# EAGLE schematic IoT_2015 (EAGLE 7.3.0)
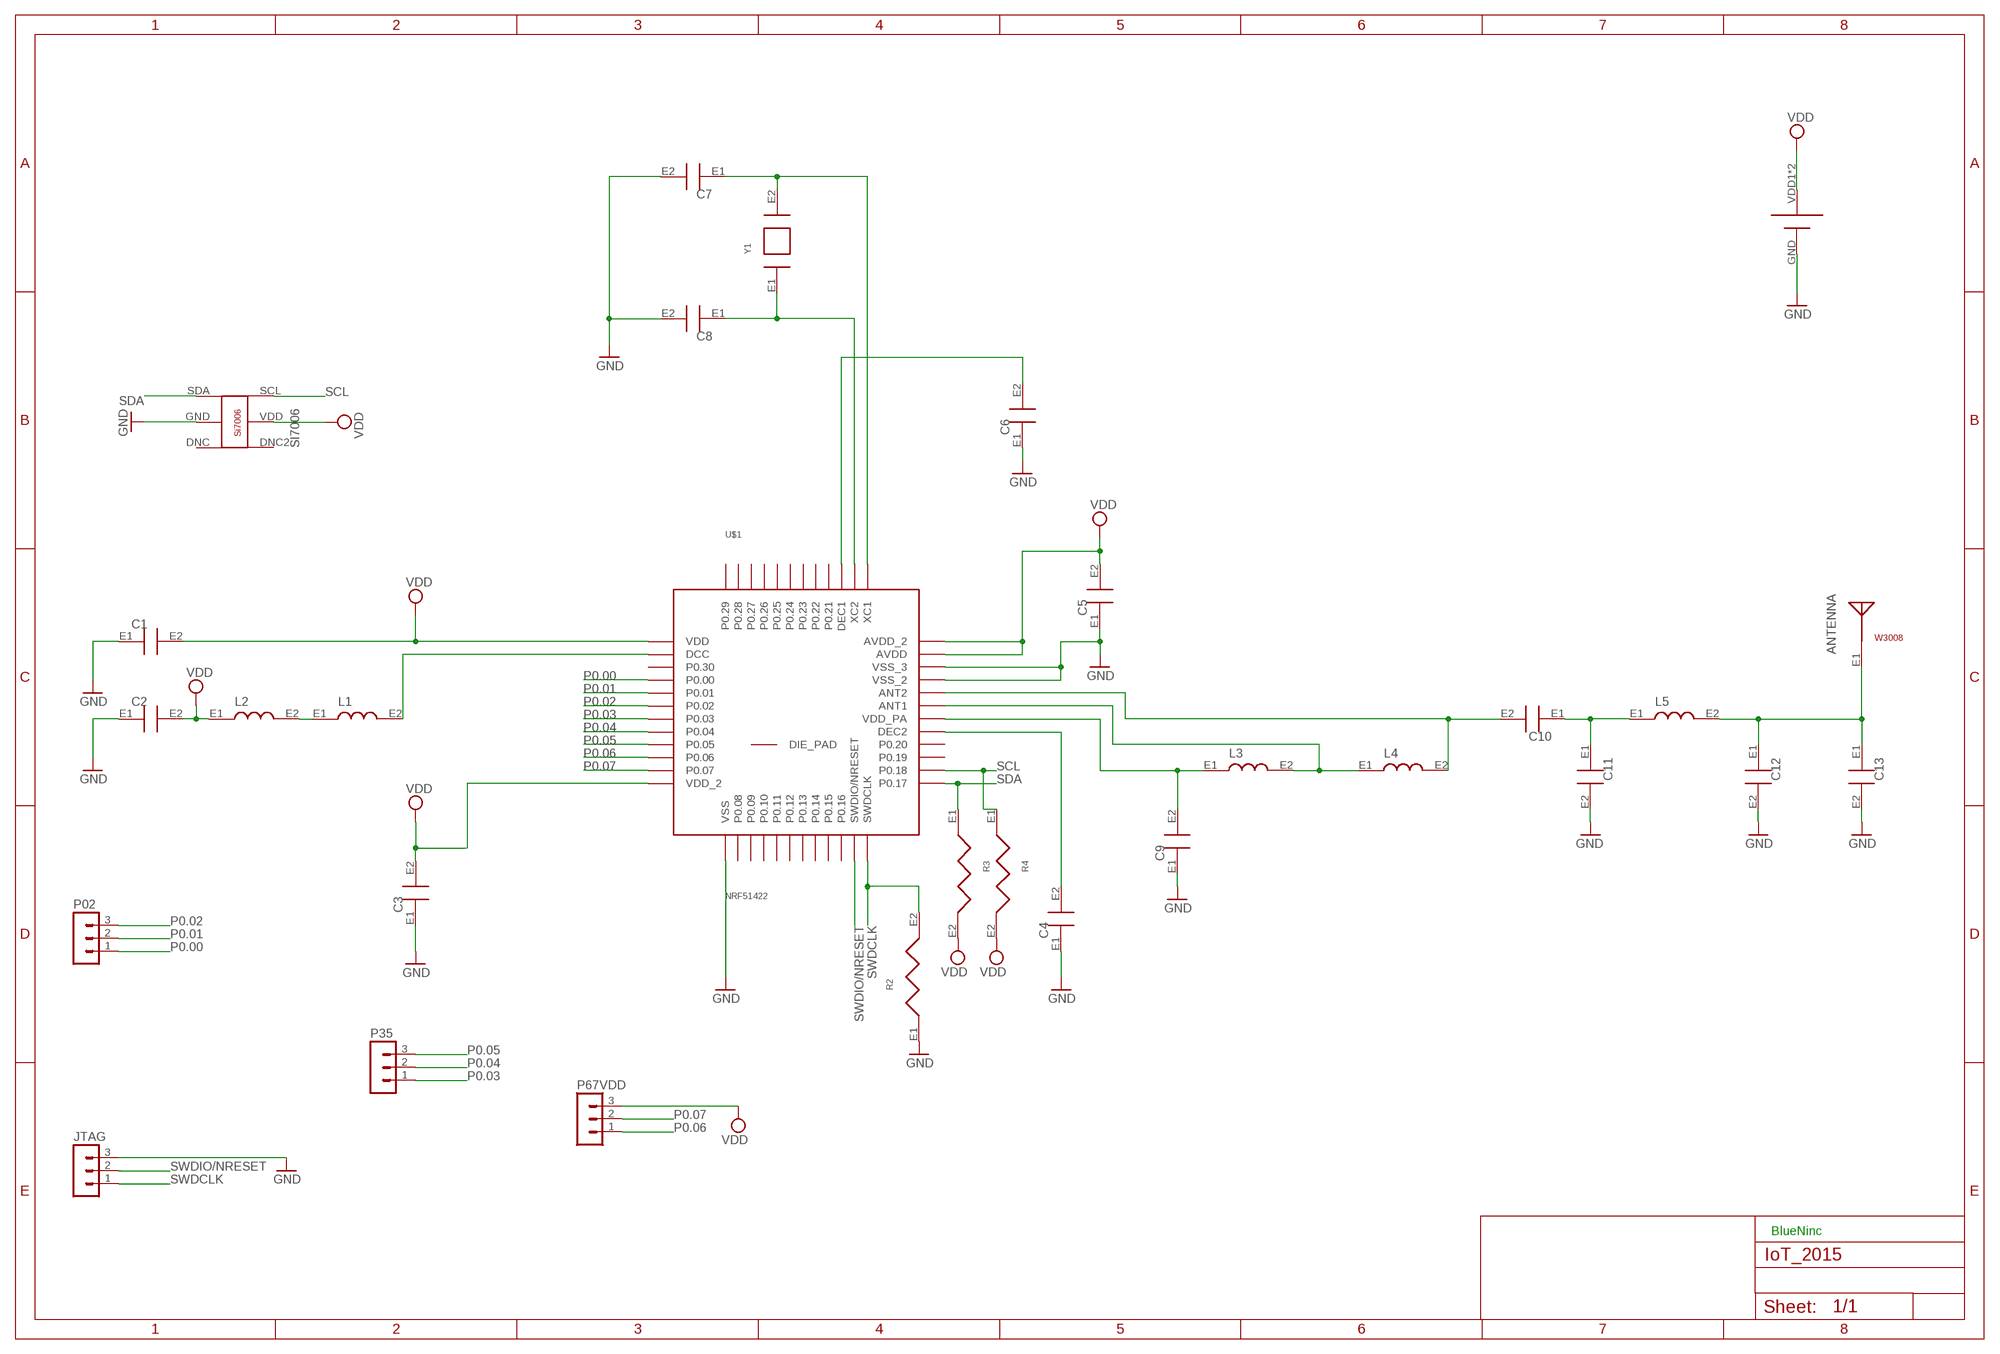
[diagram p0: schematic, sheet 1]

## Parts
ANTENNA  W3008  [W3008]
BATTERY  BAT-HLD-001  [BAT-HLD-001]
C1  VJ1603_W1BC  [VJ1603_W1BC]
C2  VJ1603_W1BC  [VJ1603_W1BC]
C3  VJ1603_W1BC  [VJ1603_W1BC]
C4  VJ1603_W1BC  [VJ1603_W1BC]
C5  VJ1603_W1BC  [VJ1603_W1BC]
C6  VJ1603_W1BC  [VJ1603_W1BC]
C7  VJ1603_W1BC  [VJ1603_W1BC]
C8  VJ1603_W1BC  [VJ1603_W1BC]
C9  VJ1603_W1BC  [VJ1603_W1BC]
C10  VJ1603_W1BC  [VJ1603_W1BC]
C11  VJ1603_W1BC  [VJ1603_W1BC]
C12  VJ1603_W1BC  [VJ1603_W1BC]
C13  VJ1603_W1BC  [VJ1603_W1BC]
JTAG  MA03-1  [MA03-1]
L1  JTI_CAT_2012_INDUCTORS_CHIP-242427  [JTI_CAT_2012_INDUCTORS_CHIP-242427]
L2  JTI_CAT_2012_INDUCTORS_CHIP-242427  [JTI_CAT_2012_INDUCTORS_CHIP-242427]
L3  JTI_CAT_2012_INDUCTORS_CHIP-242427  [JTI_CAT_2012_INDUCTORS_CHIP-242427]
L4  JTI_CAT_2012_INDUCTORS_CHIP-242427  [JTI_CAT_2012_INDUCTORS_CHIP-242427]
L5  JTI_CAT_2012_INDUCTORS_CHIP-242427  [JTI_CAT_2012_INDUCTORS_CHIP-242427]
P02  MA03-1  [MA03-1]
P35  MA03-1  [MA03-1]
P67VDD  MA03-1  [MA03-1]
R2  ERJ-3GEYJ103V  [ERJ-3GEYJ103V]
R3  ERJ-3GEYJ103V  [ERJ-3GEYJ103V]
R4  ERJ-3GEYJ103V  [ERJ-3GEYJ103V]
SI7006  SI7006-A20-IM  [SI7006-A20-IM]
U$1  NRF51422  [QFN48]
Y1  ABLS-16.000MHZ-B4-T  [ABLS-16.000MHZ-B4-T]

## Nets
GND: BATTERY.GND C1.E1 C2.E1 C3.E1 C4.E1 C5.E1 C6.E1 C7.E2 C8.E2 C9.E1 C11.E2 C12.E2 C13.E2 JTAG.3 R2.E1 SI7006.GND U$1.13(VSS) U$1.33(VSS_2) U$1.34(VSS_3)
N$1: L1.E1 L2.E2
N$2: L1.E2 U$1.2(DCC)
N$3: C4.E2 U$1.29(DEC2)
N$4: ANTENNA.E1 C12.E1 C13.E1 L5.E2
N$5: C9.E2 L3.E1 U$1.30(VDD_PA)
N$6: L3.E2 L4.E1 U$1.31(ANT1)
N$7: C10.E2 L4.E2 U$1.32(ANT2)
N$8: C6.E2 U$1.39(DEC1)
N$9: C8.E1 U$1.38(XC2) Y1.E1
N$10: C7.E1 U$1.37(XC1) Y1.E2
N$11: C10.E1 C11.E1 L5.E1
P0.00: P02.1 U$1.4(P0.00)
P0.01: P02.2 U$1.5(P0.01)
P0.02: P02.3 U$1.6(P0.02)
P0.03: P35.1 U$1.7(P0.03)
P0.04: P35.2 U$1.8(P0.04)
P0.05: P35.3 U$1.9(P0.05)
P0.06: P67VDD.1 U$1.10(P0.06)
P0.07: P67VDD.2 U$1.11(P0.07)
SCL: R4.E1 SI7006.SCL U$1.26(P0.18)
SDA: R3.E1 SI7006.SDA U$1.25(P0.17)
SWDCLK: JTAG.1 R2.E2 U$1.24(SWDCLK)
SWDIO/NRESET: JTAG.2 U$1.23(SWDIO/NRESET)
VDD: BATTERY.VDD1(VDD) BATTERY.VDD2(VDD) C1.E2 C2.E2 C3.E2 C5.E2 L2.E1 P67VDD.3 R3.E2 R4.E2 SI7006.VDD U$1.1(VDD) U$1.12(VDD_2) U$1.35(AVDD) U$1.36(AVDD_2)
Unconnected: SI7006.DNC SI7006.DNC2 U$1.3(P0.30) U$1.14(P0.08) U$1.15(P0.09) U$1.16(P0.10) U$1.17(P0.11) U$1.18(P0.12) U$1.19(P0.13) U$1.20(P0.14) U$1.21(P0.15) U$1.22(P0.16) U$1.27(P0.19) U$1.28(P0.20) U$1.40(P0.21) U$1.41(P0.22) U$1.42(P0.23) U$1.43(P0.24) U$1.44(P0.25) U$1.45(P0.26) U$1.46(P0.27) U$1.47(P0.28) U$1.48(P0.29) U$1.GND(DIE_PAD)

## Notes on the sheet
- BlueNinc

## Library data of the parts
ANTENNA = Pulse:W3008
BATTERY = BAT-HLD-001:BAT-HLD-001
C1-C13 = Vishay:VJ1603_W1BC
JTAG P02 P35 P67VDD = con-lstb:MA03-1: PIN HEADER; OC_FARNELL: unknown; OC_NEWARK: unknown
L1-L5 = JohansonTechnology:JTI_CAT_2012_INDUCTORS_CHIP-242427
R2-R4 = Panasonic:ERJ-3GEYJ103V
SI7006 = SiliconLabs:SI7006-A20-IM
U$1 = NordicSemi:NRF51422: Bluetooth 4.0 Low Energy/2.4Ghz NORDIC SEMICONDUCTOR
Y1 = Abracon:ABLS-16.000MHZ-B4-T